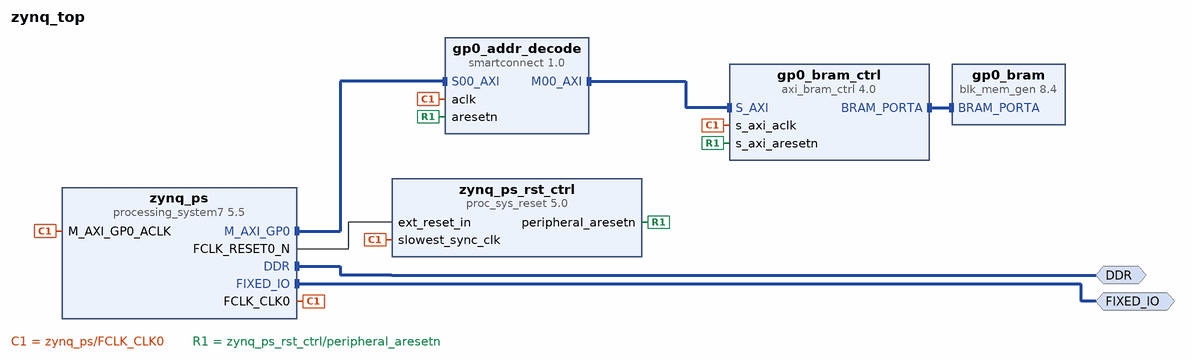
[diagram p0: block diagram of the top level]
# Vivado block design zynq_top, xc7z010clg400-1, Vivado 2017.4
create_bd_design zynq_top

create_bd_intf_port -mode Master -vlnv xilinx.com:interface:ddrx_rtl:1.0 DDR
create_bd_intf_port -mode Master -vlnv xilinx.com:display_processing_system7:fixedio_rtl:1.0 FIXED_IO

create_bd_cell -type ip -vlnv xilinx.com:ip:processing_system7:5.5 zynq_ps
set_property -dict [list \
  CONFIG.PCW_UIPARAM_DDR_FREQ_MHZ 533.333333 \
  CONFIG.PCW_APU_PERIPHERAL_FREQMHZ 667 \
  CONFIG.PCW_SDIO_PERIPHERAL_FREQMHZ 25 \
  CONFIG.PCW_UART_PERIPHERAL_FREQMHZ 50 \
  CONFIG.PCW_FPGA0_PERIPHERAL_FREQMHZ 160 \
  CONFIG.PCW_FPGA1_PERIPHERAL_FREQMHZ 100 \
  CONFIG.PCW_FPGA2_PERIPHERAL_FREQMHZ 33.333333 \
  CONFIG.PCW_M_AXI_GP0_FREQMHZ 100 \
  CONFIG.PCW_GP0_EN_MODIFIABLE_TXN 0 \
  CONFIG.PCW_GP1_EN_MODIFIABLE_TXN 0 \
  CONFIG.PCW_PERIPHERAL_BOARD_PRESET part0 \
  CONFIG.PCW_PRESET_BANK1_VOLTAGE {LVCMOS 1.8V} \
  CONFIG.PCW_UIPARAM_DDR_PARTNO {MT41K256M16 RE-125} \
  CONFIG.PCW_QSPI_PERIPHERAL_ENABLE 1 \
  CONFIG.PCW_QSPI_QSPI_IO {MIO 1 .. 6} \
  CONFIG.PCW_QSPI_GRP_SINGLE_SS_ENABLE 1 \
  CONFIG.PCW_QSPI_GRP_SINGLE_SS_IO {MIO 1 .. 6} \
  CONFIG.PCW_SINGLE_QSPI_DATA_MODE x4 \
  CONFIG.PCW_QSPI_GRP_FBCLK_ENABLE 1 \
  CONFIG.PCW_QSPI_GRP_FBCLK_IO {MIO 8} \
  CONFIG.PCW_ENET0_PERIPHERAL_ENABLE 1 \
  CONFIG.PCW_ENET0_ENET0_IO {MIO 16 .. 27} \
  CONFIG.PCW_ENET0_GRP_MDIO_ENABLE 1 \
  CONFIG.PCW_ENET0_GRP_MDIO_IO {MIO 52 .. 53} \
  CONFIG.PCW_ENET_RESET_ENABLE 1 \
  CONFIG.PCW_ENET_RESET_SELECT {Share reset pin} \
  CONFIG.PCW_ENET0_RESET_ENABLE 0 \
  CONFIG.PCW_SD0_PERIPHERAL_ENABLE 1 \
  CONFIG.PCW_SD0_SD0_IO {MIO 40 .. 45} \
  CONFIG.PCW_SD0_GRP_CD_ENABLE 1 \
  CONFIG.PCW_SD0_GRP_CD_IO {MIO 46} \
  CONFIG.PCW_SD0_GRP_WP_ENABLE 1 \
  CONFIG.PCW_SD0_GRP_WP_IO {MIO 50} \
  CONFIG.PCW_UART1_PERIPHERAL_ENABLE 1 \
  CONFIG.PCW_UART1_UART1_IO {MIO 48 .. 49} \
  CONFIG.PCW_TTC0_PERIPHERAL_ENABLE 1 \
  CONFIG.PCW_TTC0_TTC0_IO EMIO \
  CONFIG.PCW_USB0_PERIPHERAL_ENABLE 1 \
  CONFIG.PCW_USB0_USB0_IO {MIO 28 .. 39} \
  CONFIG.PCW_USB_RESET_ENABLE 1 \
  CONFIG.PCW_USB_RESET_SELECT {Share reset pin} \
  CONFIG.PCW_USB0_RESET_ENABLE 1 \
  CONFIG.PCW_USB0_RESET_IO {MIO 7} \
  CONFIG.PCW_I2C_RESET_ENABLE 0 \
  CONFIG.PCW_GPIO_PERIPHERAL_ENABLE 1 \
  CONFIG.PCW_GPIO_MIO_GPIO_ENABLE 1 \
  CONFIG.PCW_GPIO_MIO_GPIO_IO MIO \
] [get_bd_cells zynq_ps]
# 502 more settings of zynq_ps are not shown: defaults, MIO pin electricals, DDR timing, and values the tool derives
create_bd_cell -type ip -vlnv xilinx.com:ip:proc_sys_reset:5.0 zynq_ps_rst_ctrl
create_bd_cell -type ip -vlnv xilinx.com:ip:axi_bram_ctrl:4.0 gp0_bram_ctrl
set_property -dict {CONFIG.SINGLE_PORT_BRAM 1 CONFIG.C_SELECT_XPM 0} [get_bd_cells gp0_bram_ctrl]
create_bd_cell -type ip -vlnv xilinx.com:ip:smartconnect:1.0 gp0_addr_decode
set_property -dict {CONFIG.NUM_SI 1} [get_bd_cells gp0_addr_decode]
create_bd_cell -type ip -vlnv xilinx.com:ip:blk_mem_gen:8.4 gp0_bram
set_property -dict {CONFIG.EN_SAFETY_CKT false} [get_bd_cells gp0_bram]

# ---- connections ----

connect_bd_intf_net -intf_net processing_system7_0_M_AXI_GP0 [get_bd_intf_pins zynq_ps/M_AXI_GP0] [get_bd_intf_pins gp0_addr_decode/S00_AXI]
connect_bd_intf_net -intf_net axi_smc_M00_AXI [get_bd_intf_pins gp0_addr_decode/M00_AXI] [get_bd_intf_pins gp0_bram_ctrl/S_AXI]
connect_bd_intf_net -intf_net axi_bram_ctrl_0_BRAM_PORTA [get_bd_intf_pins gp0_bram/BRAM_PORTA] [get_bd_intf_pins gp0_bram_ctrl/BRAM_PORTA]
connect_bd_intf_net -intf_net processing_system7_0_DDR [get_bd_intf_ports DDR] [get_bd_intf_pins zynq_ps/DDR]
connect_bd_intf_net -intf_net processing_system7_0_FIXED_IO [get_bd_intf_ports FIXED_IO] [get_bd_intf_pins zynq_ps/FIXED_IO]
connect_bd_net -net processing_system7_0_FCLK_CLK0 [get_bd_pins zynq_ps/FCLK_CLK0] \
  [get_bd_pins zynq_ps/M_AXI_GP0_ACLK] [get_bd_pins zynq_ps_rst_ctrl/slowest_sync_clk] [get_bd_pins gp0_bram_ctrl/s_axi_aclk] \
  [get_bd_pins gp0_addr_decode/aclk]
connect_bd_net -net processing_system7_0_FCLK_RESET0_N [get_bd_pins zynq_ps/FCLK_RESET0_N] [get_bd_pins zynq_ps_rst_ctrl/ext_reset_in]
connect_bd_net -net rst_ps7_0_100M_peripheral_aresetn [get_bd_pins zynq_ps_rst_ctrl/peripheral_aresetn] \
  [get_bd_pins gp0_bram_ctrl/s_axi_aresetn] [get_bd_pins gp0_addr_decode/aresetn]

# ---- address map ----
assign_bd_address -offset 0x40000000 -range 4K -target_address_space [get_bd_addr_spaces zynq_ps/Data] [get_bd_addr_segs gp0_bram_ctrl/S_AXI/Mem0]

validate_bd_design
save_bd_design
